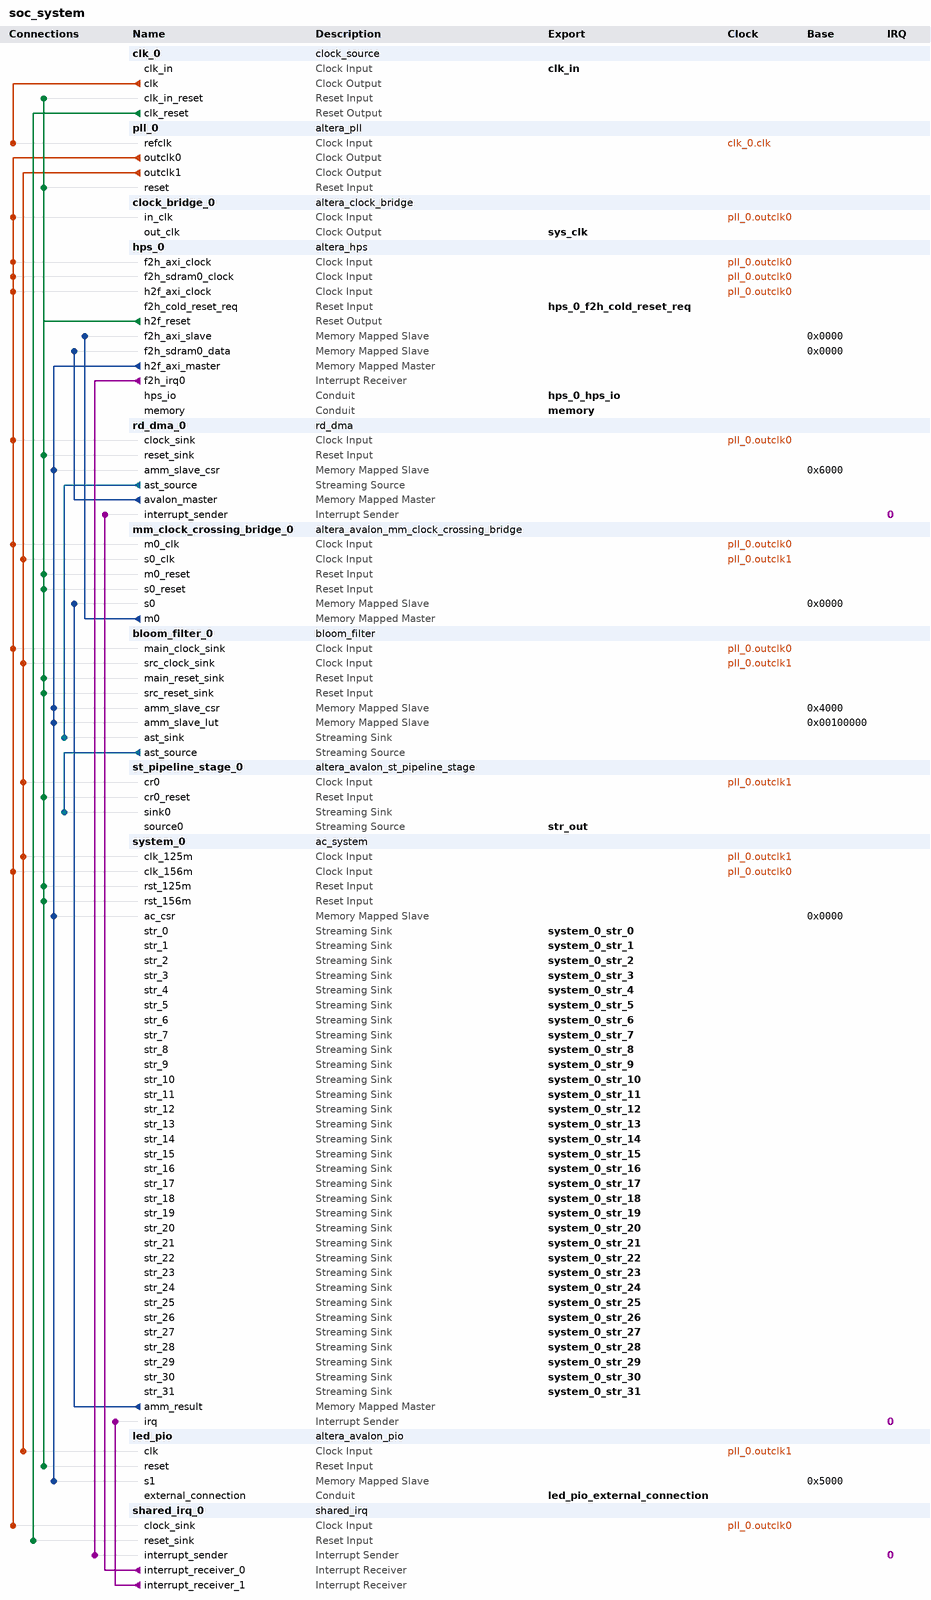
[diagram p0: system contents]
# Platform Designer (Qsys) system soc_system, Cyclone V 5CSEBA6U23I7
# Parameters at their usual value, and those the tool derives, are not listed.
package require -exact qsys 16.1
create_system soc_system
set_project_property DEVICE_FAMILY {Cyclone V}
set_project_property DEVICE 5CSEBA6U23I7

add_instance clk_0 clock_source 16.1
set_instance_parameter_value clk_0 clockFrequency 50000000

add_instance pll_0 altera_pll 16.1
set_instance_parameter_value pll_0 gui_device_speed_grade 2
set_instance_parameter_value pll_0 gui_number_of_clocks 2
set_instance_parameter_value pll_0 gui_operation_mode direct
set_instance_parameter_value pll_0 gui_output_clock_frequency0 75.0
set_instance_parameter_value pll_0 gui_output_clock_frequency1 50.0
set_instance_parameter_value pll_0 gui_pll_mode {Integer-N PLL}
set_instance_parameter_value pll_0 gui_reference_clock_frequency 50.0
set_instance_parameter_value pll_0 gui_use_locked false

add_instance clock_bridge_0 altera_clock_bridge 16.1
set_instance_parameter_value clock_bridge_0 DERIVED_CLOCK_RATE 75000000
set_instance_parameter_value clock_bridge_0 EXPLICIT_CLOCK_RATE 0

add_instance hps_0 altera_hps 16.1
set_instance_parameter_value hps_0 EMAC1_Mode RGMII
set_instance_parameter_value hps_0 EMAC1_PinMuxing {HPS I/O Set 0}
set_instance_parameter_value hps_0 F2SCLK_COLDRST_Enable true
set_instance_parameter_value hps_0 F2SCLK_DBGRST_Enable false
set_instance_parameter_value hps_0 F2SCLK_WARMRST_Enable false
set_instance_parameter_value hps_0 F2SDRAM_Type {Avalon-MM Read-Only}
set_instance_parameter_value hps_0 F2SDRAM_Width 64
set_instance_parameter_value hps_0 F2SINTERRUPT_Enable true
set_instance_parameter_value hps_0 F2S_Width 2
set_instance_parameter_value hps_0 FPGA_PERIPHERAL_OUTPUT_CLOCK_FREQ_EMAC0_GTX_CLK 100
set_instance_parameter_value hps_0 FPGA_PERIPHERAL_OUTPUT_CLOCK_FREQ_EMAC0_MD_CLK 100.0
set_instance_parameter_value hps_0 FPGA_PERIPHERAL_OUTPUT_CLOCK_FREQ_EMAC1_GTX_CLK 100
set_instance_parameter_value hps_0 FPGA_PERIPHERAL_OUTPUT_CLOCK_FREQ_EMAC1_MD_CLK 100.0
set_instance_parameter_value hps_0 HPS_PROTOCOL DDR3
set_instance_parameter_value hps_0 I2C0_Mode I2C
set_instance_parameter_value hps_0 I2C0_PinMuxing {HPS I/O Set 0}
set_instance_parameter_value hps_0 I2C1_Mode I2C
set_instance_parameter_value hps_0 I2C1_PinMuxing {HPS I/O Set 0}
set_instance_parameter_value hps_0 LWH2F_Enable false
set_instance_parameter_value hps_0 MEM_BANKADDR_WIDTH 3
set_instance_parameter_value hps_0 MEM_CLK_FREQ 400.0
set_instance_parameter_value hps_0 MEM_COL_ADDR_WIDTH 10
set_instance_parameter_value hps_0 MEM_DQ_WIDTH 32
set_instance_parameter_value hps_0 MEM_DRV_STR RZQ/6
set_instance_parameter_value hps_0 MEM_ROW_ADDR_WIDTH 15
set_instance_parameter_value hps_0 MEM_RTT_NOM RZQ/6
set_instance_parameter_value hps_0 MEM_RTT_WR {Dynamic ODT off}
set_instance_parameter_value hps_0 MEM_TCL 7
set_instance_parameter_value hps_0 MEM_TFAW_NS 37.5
set_instance_parameter_value hps_0 MEM_TRAS_NS 35.0
set_instance_parameter_value hps_0 MEM_TRCD_NS 13.75
set_instance_parameter_value hps_0 MEM_TRFC_NS 300.0
set_instance_parameter_value hps_0 MEM_TRP_NS 13.75
set_instance_parameter_value hps_0 MEM_VENDOR Other
set_instance_parameter_value hps_0 MEM_WTCL 7
set_instance_parameter_value hps_0 QSPI_Mode N/A
set_instance_parameter_value hps_0 QSPI_PinMuxing Unused
set_instance_parameter_value hps_0 REF_CLK_FREQ 25.0
set_instance_parameter_value hps_0 S2FCLK_USER2CLK 4
set_instance_parameter_value hps_0 S2F_Width 2
set_instance_parameter_value hps_0 SDIO_Mode {4-bit Data}
set_instance_parameter_value hps_0 SDIO_PinMuxing {HPS I/O Set 0}
set_instance_parameter_value hps_0 SPIM1_Mode {Single Slave Select}
set_instance_parameter_value hps_0 SPIM1_PinMuxing {HPS I/O Set 0}
set_instance_parameter_value hps_0 STM_Enable false
set_instance_parameter_value hps_0 TIMING_BOARD_AC_SKEW 0.02
set_instance_parameter_value hps_0 TIMING_BOARD_AC_TO_CK_SKEW 0.0
set_instance_parameter_value hps_0 TIMING_BOARD_DQ_TO_DQS_SKEW 0.0
set_instance_parameter_value hps_0 TIMING_BOARD_MAX_CK_DELAY 0.6
set_instance_parameter_value hps_0 TIMING_BOARD_MAX_DQS_DELAY 0.6
set_instance_parameter_value hps_0 TIMING_BOARD_SKEW_BETWEEN_DQS 0.02
set_instance_parameter_value hps_0 TIMING_BOARD_SKEW_CKDQS_DIMM_MAX 0.01
set_instance_parameter_value hps_0 TIMING_BOARD_SKEW_CKDQS_DIMM_MIN -0.01
set_instance_parameter_value hps_0 TIMING_BOARD_SKEW_WITHIN_DQS 0.02
set_instance_parameter_value hps_0 TIMING_TDH 125
set_instance_parameter_value hps_0 TIMING_TDQSCK 400
set_instance_parameter_value hps_0 TIMING_TDQSQ 120
set_instance_parameter_value hps_0 TIMING_TDS 50
set_instance_parameter_value hps_0 TIMING_TIH 250
set_instance_parameter_value hps_0 TIMING_TIS 175
set_instance_parameter_value hps_0 TIMING_TQSH 0.38
set_instance_parameter_value hps_0 UART0_Mode {No Flow Control}
set_instance_parameter_value hps_0 UART0_PinMuxing {HPS I/O Set 0}
set_instance_parameter_value hps_0 USB1_Mode SDR
set_instance_parameter_value hps_0 USB1_PinMuxing {HPS I/O Set 0}
set_instance_parameter_value hps_0 desired_cfg_clk_mhz 100.0
set_instance_parameter_value hps_0 desired_qspi_clk_mhz 370.0

add_instance rd_dma_0 rd_dma 1.0
set_instance_parameter_value rd_dma_0 AMM_CSR_ADDR_W 4
set_instance_parameter_value rd_dma_0 AMM_CSR_DATA_W 32
set_instance_parameter_value rd_dma_0 AMM_DMA_ADDR_W 32
set_instance_parameter_value rd_dma_0 AMM_DMA_BURST_SIZE 128
set_instance_parameter_value rd_dma_0 AMM_DMA_BURST_W 11
set_instance_parameter_value rd_dma_0 AMM_DMA_DATA_W 64
set_instance_parameter_value rd_dma_0 AST_SOURCE_EMPTY_W 3

add_instance mm_clock_crossing_bridge_0 altera_avalon_mm_clock_crossing_bridge 16.1
set_instance_parameter_value mm_clock_crossing_bridge_0 ADDRESS_WIDTH 10
set_instance_parameter_value mm_clock_crossing_bridge_0 COMMAND_FIFO_DEPTH 4
set_instance_parameter_value mm_clock_crossing_bridge_0 DATA_WIDTH 64
set_instance_parameter_value mm_clock_crossing_bridge_0 MASTER_SYNC_DEPTH 2
set_instance_parameter_value mm_clock_crossing_bridge_0 MAX_BURST_SIZE 1
set_instance_parameter_value mm_clock_crossing_bridge_0 RESPONSE_FIFO_DEPTH 4
set_instance_parameter_value mm_clock_crossing_bridge_0 SLAVE_SYNC_DEPTH 2
set_instance_parameter_value mm_clock_crossing_bridge_0 USE_AUTO_ADDRESS_WIDTH 1

add_instance bloom_filter_0 bloom_filter 1.0
set_instance_parameter_value bloom_filter_0 AMM_CSR_ADDR_W 4
set_instance_parameter_value bloom_filter_0 AMM_CSR_DATA_W 16
set_instance_parameter_value bloom_filter_0 AMM_LUT_ADDR_W 20
set_instance_parameter_value bloom_filter_0 AMM_LUT_DATA_W 8
set_instance_parameter_value bloom_filter_0 AST_SINK_ORDER false
set_instance_parameter_value bloom_filter_0 AST_SINK_SYMBOLS 8
set_instance_parameter_value bloom_filter_0 AST_SOURCE_ORDER true
set_instance_parameter_value bloom_filter_0 AST_SOURCE_SYMBOLS 1
set_instance_parameter_value bloom_filter_0 BYTE_W 8
set_instance_parameter_value bloom_filter_0 HASHES_CNT 4
set_instance_parameter_value bloom_filter_0 HASH_LUT_MODE 1
set_instance_parameter_value bloom_filter_0 HASH_W 13
set_instance_parameter_value bloom_filter_0 MAX_STR_SIZE 10
set_instance_parameter_value bloom_filter_0 MIN_STR_SIZE 4
set_instance_parameter_value bloom_filter_0 OUTPUT_FIFO_DEPTH 128

add_instance st_pipeline_stage_0 altera_avalon_st_pipeline_stage 16.1
set_instance_parameter_value st_pipeline_stage_0 BITS_PER_SYMBOL 8
set_instance_parameter_value st_pipeline_stage_0 CHANNEL_WIDTH 0
set_instance_parameter_value st_pipeline_stage_0 ERROR_WIDTH 0
set_instance_parameter_value st_pipeline_stage_0 MAX_CHANNEL 0
set_instance_parameter_value st_pipeline_stage_0 PIPELINE_READY 1
set_instance_parameter_value st_pipeline_stage_0 SYMBOLS_PER_BEAT 1
set_instance_parameter_value st_pipeline_stage_0 USE_EMPTY 0
set_instance_parameter_value st_pipeline_stage_0 USE_PACKETS 1

add_instance system_0 ac_system 1.0

add_instance led_pio altera_avalon_pio 16.1
set_instance_parameter_value led_pio direction Output
set_instance_parameter_value led_pio resetValue 127
set_instance_parameter_value led_pio width 7

add_instance shared_irq_0 shared_irq 1.0

# connections
add_connection clk_0.clk pll_0.refclk clock
add_connection pll_0.outclk0 bloom_filter_0.main_clock_sink clock
add_connection pll_0.outclk0 clock_bridge_0.in_clk clock
add_connection pll_0.outclk0 hps_0.f2h_axi_clock clock
add_connection pll_0.outclk0 hps_0.f2h_sdram0_clock clock
add_connection pll_0.outclk0 hps_0.h2f_axi_clock clock
add_connection pll_0.outclk0 mm_clock_crossing_bridge_0.m0_clk clock
add_connection pll_0.outclk0 rd_dma_0.clock_sink clock
add_connection pll_0.outclk0 shared_irq_0.clock_sink clock
add_connection pll_0.outclk0 system_0.clk_156m clock
add_connection pll_0.outclk1 bloom_filter_0.src_clock_sink clock
add_connection pll_0.outclk1 led_pio.clk clock
add_connection pll_0.outclk1 mm_clock_crossing_bridge_0.s0_clk clock
add_connection pll_0.outclk1 st_pipeline_stage_0.cr0 clock
add_connection pll_0.outclk1 system_0.clk_125m clock
add_connection clk_0.clk_reset shared_irq_0.reset_sink reset
add_connection hps_0.h2f_reset bloom_filter_0.main_reset_sink reset
add_connection hps_0.h2f_reset bloom_filter_0.src_reset_sink reset
add_connection hps_0.h2f_reset clk_0.clk_in_reset reset
add_connection hps_0.h2f_reset led_pio.reset reset
add_connection hps_0.h2f_reset mm_clock_crossing_bridge_0.m0_reset reset
add_connection hps_0.h2f_reset mm_clock_crossing_bridge_0.s0_reset reset
add_connection hps_0.h2f_reset pll_0.reset reset
add_connection hps_0.h2f_reset rd_dma_0.reset_sink reset
add_connection hps_0.h2f_reset st_pipeline_stage_0.cr0_reset reset
add_connection hps_0.h2f_reset system_0.rst_125m reset
add_connection hps_0.h2f_reset system_0.rst_156m reset
add_connection hps_0.h2f_axi_master bloom_filter_0.amm_slave_csr avalon
set_connection_parameter_value hps_0.h2f_axi_master/bloom_filter_0.amm_slave_csr baseAddress 0x4000
add_connection hps_0.h2f_axi_master bloom_filter_0.amm_slave_lut avalon
set_connection_parameter_value hps_0.h2f_axi_master/bloom_filter_0.amm_slave_lut baseAddress 0x00100000
add_connection hps_0.h2f_axi_master led_pio.s1 avalon
set_connection_parameter_value hps_0.h2f_axi_master/led_pio.s1 baseAddress 0x5000
add_connection hps_0.h2f_axi_master rd_dma_0.amm_slave_csr avalon
set_connection_parameter_value hps_0.h2f_axi_master/rd_dma_0.amm_slave_csr baseAddress 0x6000
add_connection hps_0.h2f_axi_master system_0.ac_csr avalon
set_connection_parameter_value hps_0.h2f_axi_master/system_0.ac_csr baseAddress 0x0000
add_connection mm_clock_crossing_bridge_0.m0 hps_0.f2h_axi_slave avalon
set_connection_parameter_value mm_clock_crossing_bridge_0.m0/hps_0.f2h_axi_slave baseAddress 0x0000
add_connection rd_dma_0.avalon_master hps_0.f2h_sdram0_data avalon
set_connection_parameter_value rd_dma_0.avalon_master/hps_0.f2h_sdram0_data baseAddress 0x0000
add_connection system_0.amm_result mm_clock_crossing_bridge_0.s0 avalon
set_connection_parameter_value system_0.amm_result/mm_clock_crossing_bridge_0.s0 baseAddress 0x0000
add_connection bloom_filter_0.ast_source st_pipeline_stage_0.sink0 avalon_streaming
add_connection rd_dma_0.ast_source bloom_filter_0.ast_sink avalon_streaming
add_connection hps_0.f2h_irq0 shared_irq_0.interrupt_sender interrupt
set_connection_parameter_value hps_0.f2h_irq0/shared_irq_0.interrupt_sender irqNumber 0
add_connection shared_irq_0.interrupt_receiver_0 rd_dma_0.interrupt_sender interrupt
set_connection_parameter_value shared_irq_0.interrupt_receiver_0/rd_dma_0.interrupt_sender irqNumber 0
add_connection shared_irq_0.interrupt_receiver_1 system_0.irq interrupt
set_connection_parameter_value shared_irq_0.interrupt_receiver_1/system_0.irq irqNumber 0

# exported interfaces
add_interface clk_in clock sink
set_interface_property clk_in EXPORT_OF clk_0.clk_in
add_interface hps_0_f2h_cold_reset_req reset sink
set_interface_property hps_0_f2h_cold_reset_req EXPORT_OF hps_0.f2h_cold_reset_req
add_interface hps_0_hps_io conduit end
set_interface_property hps_0_hps_io EXPORT_OF hps_0.hps_io
add_interface led_pio_external_connection conduit end
set_interface_property led_pio_external_connection EXPORT_OF led_pio.external_connection
add_interface memory conduit end
set_interface_property memory EXPORT_OF hps_0.memory
add_interface str_out avalon_streaming source
set_interface_property str_out EXPORT_OF st_pipeline_stage_0.source0
add_interface sys_clk clock source
set_interface_property sys_clk EXPORT_OF clock_bridge_0.out_clk
add_interface system_0_str_0 avalon_streaming sink
set_interface_property system_0_str_0 EXPORT_OF system_0.str_0
add_interface system_0_str_1 avalon_streaming sink
set_interface_property system_0_str_1 EXPORT_OF system_0.str_1
add_interface system_0_str_10 avalon_streaming sink
set_interface_property system_0_str_10 EXPORT_OF system_0.str_10
add_interface system_0_str_11 avalon_streaming sink
set_interface_property system_0_str_11 EXPORT_OF system_0.str_11
add_interface system_0_str_12 avalon_streaming sink
set_interface_property system_0_str_12 EXPORT_OF system_0.str_12
add_interface system_0_str_13 avalon_streaming sink
set_interface_property system_0_str_13 EXPORT_OF system_0.str_13
add_interface system_0_str_14 avalon_streaming sink
set_interface_property system_0_str_14 EXPORT_OF system_0.str_14
add_interface system_0_str_15 avalon_streaming sink
set_interface_property system_0_str_15 EXPORT_OF system_0.str_15
add_interface system_0_str_16 avalon_streaming sink
set_interface_property system_0_str_16 EXPORT_OF system_0.str_16
add_interface system_0_str_17 avalon_streaming sink
set_interface_property system_0_str_17 EXPORT_OF system_0.str_17
add_interface system_0_str_18 avalon_streaming sink
set_interface_property system_0_str_18 EXPORT_OF system_0.str_18
add_interface system_0_str_19 avalon_streaming sink
set_interface_property system_0_str_19 EXPORT_OF system_0.str_19
add_interface system_0_str_2 avalon_streaming sink
set_interface_property system_0_str_2 EXPORT_OF system_0.str_2
add_interface system_0_str_20 avalon_streaming sink
set_interface_property system_0_str_20 EXPORT_OF system_0.str_20
add_interface system_0_str_21 avalon_streaming sink
set_interface_property system_0_str_21 EXPORT_OF system_0.str_21
add_interface system_0_str_22 avalon_streaming sink
set_interface_property system_0_str_22 EXPORT_OF system_0.str_22
add_interface system_0_str_23 avalon_streaming sink
set_interface_property system_0_str_23 EXPORT_OF system_0.str_23
add_interface system_0_str_24 avalon_streaming sink
set_interface_property system_0_str_24 EXPORT_OF system_0.str_24
add_interface system_0_str_25 avalon_streaming sink
set_interface_property system_0_str_25 EXPORT_OF system_0.str_25
add_interface system_0_str_26 avalon_streaming sink
set_interface_property system_0_str_26 EXPORT_OF system_0.str_26
add_interface system_0_str_27 avalon_streaming sink
set_interface_property system_0_str_27 EXPORT_OF system_0.str_27
add_interface system_0_str_28 avalon_streaming sink
set_interface_property system_0_str_28 EXPORT_OF system_0.str_28
add_interface system_0_str_29 avalon_streaming sink
set_interface_property system_0_str_29 EXPORT_OF system_0.str_29
add_interface system_0_str_3 avalon_streaming sink
set_interface_property system_0_str_3 EXPORT_OF system_0.str_3
add_interface system_0_str_30 avalon_streaming sink
set_interface_property system_0_str_30 EXPORT_OF system_0.str_30
add_interface system_0_str_31 avalon_streaming sink
set_interface_property system_0_str_31 EXPORT_OF system_0.str_31
add_interface system_0_str_4 avalon_streaming sink
set_interface_property system_0_str_4 EXPORT_OF system_0.str_4
add_interface system_0_str_5 avalon_streaming sink
set_interface_property system_0_str_5 EXPORT_OF system_0.str_5
add_interface system_0_str_6 avalon_streaming sink
set_interface_property system_0_str_6 EXPORT_OF system_0.str_6
add_interface system_0_str_7 avalon_streaming sink
set_interface_property system_0_str_7 EXPORT_OF system_0.str_7
add_interface system_0_str_8 avalon_streaming sink
set_interface_property system_0_str_8 EXPORT_OF system_0.str_8
add_interface system_0_str_9 avalon_streaming sink
set_interface_property system_0_str_9 EXPORT_OF system_0.str_9

set_interconnect_requirement {$system} qsys_mm.clockCrossingAdapter HANDSHAKE
set_interconnect_requirement {$system} qsys_mm.maxAdditionalLatency 1

save_system soc_system.qsys
